# Altium schematic sheet DEMO_mega16_2020_SMT.SchDoc
size A3
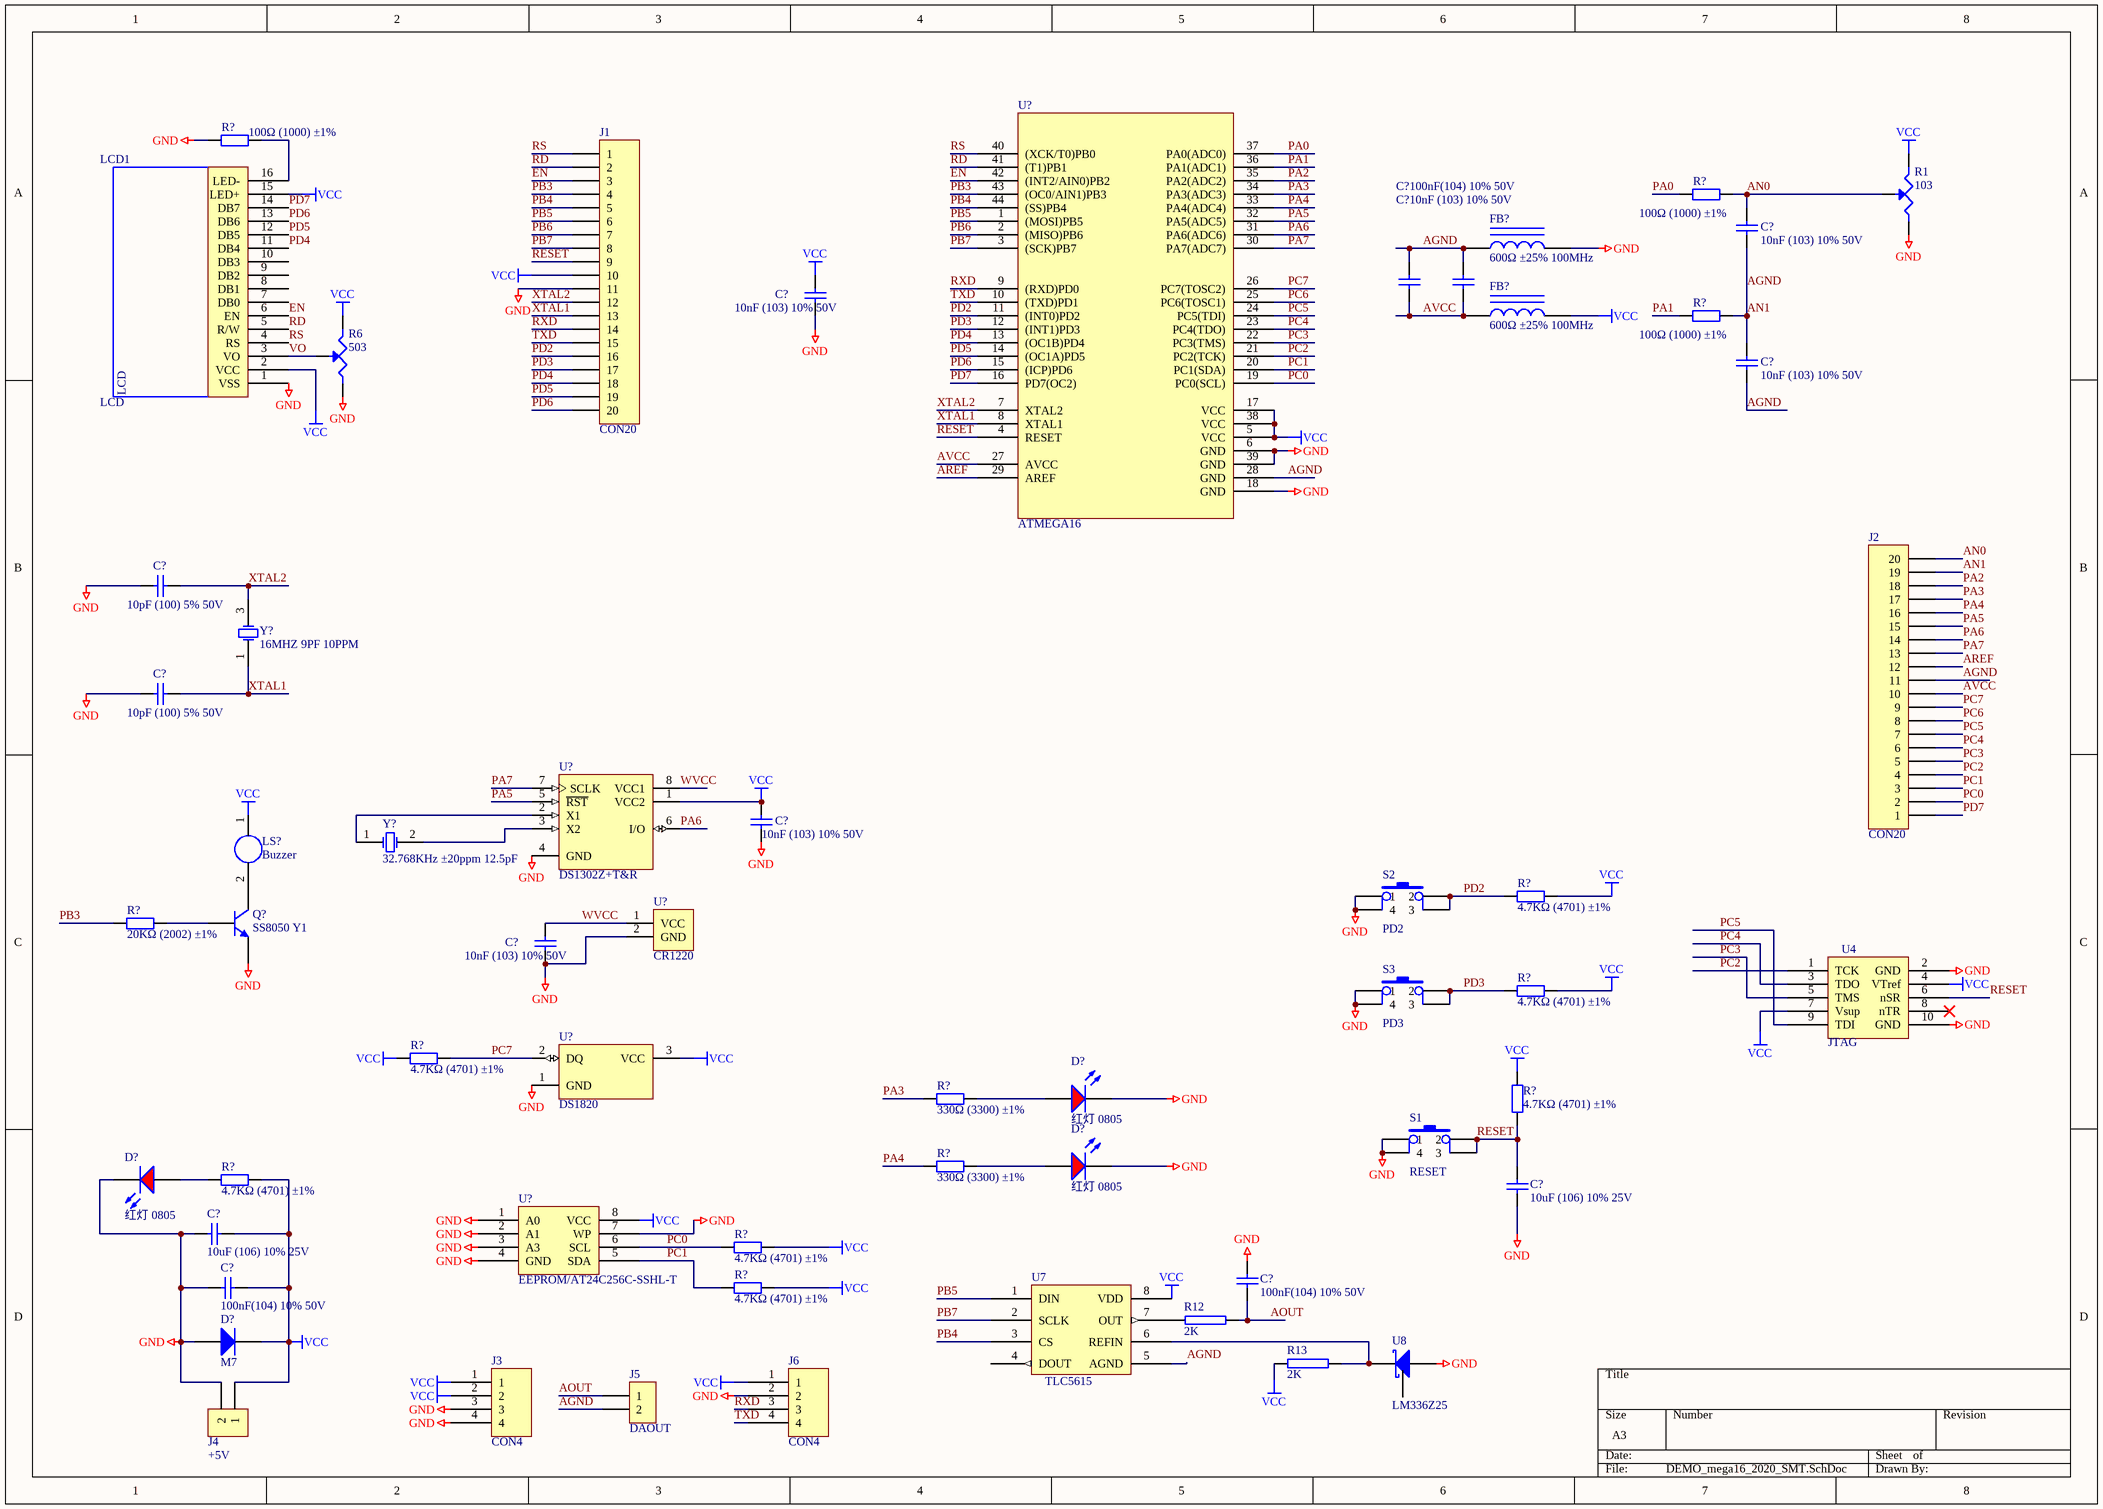
[diagram p0: DEMO_mega16_2020_SMT.SchDoc]

## Parts
(Parts that share a designator on the sheet are numbered #1, #2 ... from top to bottom, then left to right.)
C?#1  10nF (103) 10% 50V  [0805_C]
C?#2  10nF (103) 10% 50V  [0805_C]
C?#3  100nF(104) 10% 50V  [0805_C]
C?#4  10nF (103) 10% 50V  [0805_C]
C?#5  10nF (103) 10% 50V  [0805_C]
C?#6  10pF (100) 5% 50V  [0805_C]
C?#7  10pF (100) 5% 50V  [0805_C]
C?#8  10nF (103) 10% 50V  [0805_C]
C?#9  10nF (103) 10% 50V  [0805_C]
C?#10  10uF (106) 10% 25V  [0805_C]
C?#11  10uF (106) 10% 25V  [0805_C]
C?#12  100nF(104) 10% 50V  [0805_C]
C?#13  100nF(104) 10% 50V  [0805_C]
D?#1  红灯 0805  [0805_LED_S1]
D?#2  红灯 0805  [0805_LED_S1]
D?#3  红灯 0805  [0805_LED_S1]
D?#4  M7  [SMA(DO-214AC)_S1]
FB?#1  600Ω ±25% 100MHz  [0805_L]
FB?#2  600Ω ±25% 100MHz  [0805_L]
J1  CON20  [SIP20]
J2  CON20  [SIP20]
J3  CON4  [SIP4]
J4  +5V  [SIP2]
J5  DAOUT  [SIP2]
J6  CON4  [SIP4]
LCD1  LCD  [SIP16]
LS?  Buzzer  [Buzzer]
Q?  SS8050 Y1  [SOT-23(SOT-23-3)]
R1  103  [VR5]
R6  503  [VR5]
R12  2K  [0805]
R13  2K  [0805]
R?#1  100Ω (1000) ±1%  [0805_R]
R?#2  100Ω (1000) ±1%  [0805_R]
R?#3  100Ω (1000) ±1%  [0805_R]
R?#4  4.7KΩ (4701) ±1%  [0805_R]
R?#5  20KΩ (2002) ±1%  [0805_R]
R?#6  4.7KΩ (4701) ±1%  [0805_R]
R?#7  4.7KΩ (4701) ±1%  [0805_R]
R?#8  330Ω (3300) ±1%  [0805_R]
R?#9  4.7KΩ (4701) ±1%  [0805_R]
R?#10  330Ω (3300) ±1%  [0805_R]
R?#11  4.7KΩ (4701) ±1%  [0805_R]
R?#12  4.7KΩ (4701) ±1%  [0805_R]
R?#13  4.7KΩ (4701) ±1%  [0805_R]
S1  RESET  [SW-PB]
S2  PD2  [SW-PB]
S3  PD3  [SW-PB]
U4  JTAG  [IDC10]
U7  TLC5615  [TLC5615]
U8  LM336Z25  [三极管]
U?#1  ATMEGA16  [TQFP44]
U?#2  DS1302Z+T&R  [SOIC-8_150mil]
U?#3  CR1220  [CR1220]
U?#4  DS1820  [三极管]
U?#5  EEPROM/AT24C256C-SSHL-T  [SOIC-8_150mil]
Y?#1  16MHZ 9PF 10PPM  [SMD-3225_4P]
Y?#2  32.768KHz ±20ppm 12.5pF  [SMD-3215_2P FC - 135]

## Nets
GND: C?#4.1 C?#6.1 C?#7.1 C?#8.1 C?#9.1 C?#10.1 C?#11.1 C?#12.1 C?#13.2 D?#1.K D?#2.K D?#3.K D?#4.1(A) FB?#1.2 J1.11 J3.3 J3.4 J4.2 J6.2 LCD1.1(VSS) Q?.2(E) R1.3 R6.3 R?#1.1 S1.1 S1.4 S2.1 S2.4 S3.1 S3.4 U4.2(GND) U4.10(GND) U8.3(-) U?#1.6(GND) U?#1.18(GND) U?#1.39(GND) U?#2.4(GND) U?#3.2(GND) U?#4.1(GND) U?#5.1(A0) U?#5.2(A1) U?#5.3(A3) U?#5.4(GND) U?#5.7(WP)
VCC: C?#4.2 C?#8.2 C?#10.2 C?#12.2 D?#4.2(K) FB?#2.2 J1.10 J3.1 J3.2 J4.1 J6.1 LCD1.2(VCC) LCD1.15(LED+) LS?.1 R1.1 R6.1 R13.1 R?#4.2 R?#6.2 R?#7.1 R?#9.2 R?#11.2 R?#12.2 R?#13.2 U4.4(VTref) U4.7(Vsup) U7.8(VDD) U?#1.5(VCC) U?#1.17(VCC) U?#1.38(VCC) U?#2.1(VCC2) U?#4.3(VCC) U?#5.8(VCC)
AGND: C?#1.1 C?#2.2 C?#3.2 C?#5.1 C?#5.2 FB?#1.1 J2.11 J2.19 J5.2 R?#3.2 U7.5(AGND) U?#1.28(GND)  [also labelled AN1]
AN0: C?#1.2 J2.20 R1.2 R?#2.2
AOUT: C?#13.1 J5.1 R12.2
AREF: J2.12 U?#1.29(AREF)
AVCC: C?#2.1 C?#3.1 FB?#2.1 J2.10 U?#1.27(AVCC)
EN: J1.3 LCD1.6(EN) U?#1.42((INT2/AIN0)PB2)
PA0: R?#2.1 U?#1.37(PA0(ADC0))
PA1: R?#3.1 U?#1.36(PA1(ADC1))
PA2: J2.18 U?#1.35(PA2(ADC2))
PA3: J2.17 R?#8.1 U?#1.34(PA3(ADC3))
PA4: J2.16 R?#10.1 U?#1.33(PA4(ADC4))
PA5: J2.15 U?#1.32(PA5(ADC5)) U?#2.5(~{RST})
PA6: J2.14 U?#1.31(PA6(ADC6)) U?#2.6(I/O)
PA7: J2.13 U?#1.30(PA7(ADC7)) U?#2.7(SCLK)
PB3: J1.4 R?#5.1 U?#1.43((OC0/AIN1)PB3)
PB4: J1.5 U7.3(CS) U?#1.44((SS)PB4)
PB5: J1.6 U7.1(DIN) U?#1.1((MOSI)PB5)
PB6: J1.7 U?#1.2((MISO)PB6)
PB7: J1.8 U7.2(SCLK) U?#1.3((SCK)PB7)
PC0: J2.2 R?#12.1 U?#1.19(PC0(SCL)) U?#5.6(SCL)
PC1: J2.3 R?#13.1 U?#1.20(PC1(SDA)) U?#5.5(SDA)
PC2: J2.4 U4.1(TCK) U?#1.21(PC2(TCK))
PC3: J2.5 U4.5(TMS) U?#1.22(PC3(TMS))
PC4: J2.6 U4.3(TDO) U?#1.23(PC4(TDO))
PC5: J2.7 U4.9(TDI) U?#1.24(PC5(TDI))
PC6: J2.8 U?#1.25(PC6(TOSC1))
PC7: J2.9 R?#7.2 U?#1.26(PC7(TOSC2)) U?#4.2(DQ)
PD2: J1.16 R?#4.1 S2.2 S2.3 U?#1.11((INT0)PD2)
PD3: J1.17 R?#6.1 S3.2 S3.3 U?#1.12((INT1)PD3)
PD4: J1.18 LCD1.11(DB4) U?#1.13((OC1B)PD4)
PD5: J1.19 LCD1.12(DB5) U?#1.14((OC1A)PD5)
PD6: J1.20 LCD1.13(DB6) U?#1.15((ICP)PD6)
PD7: J2.1 LCD1.14(DB7) U?#1.16(PD7(OC2))
RD: J1.2 LCD1.5(R/W) U?#1.41((T1)PB1)
RESET: C?#11.2 J1.9 R?#9.1 S1.2 S1.3 U4.6(nSR) U?#1.4(RESET)
RS: J1.1 LCD1.4(RS) U?#1.40((XCK/T0)PB0)
RXD: J1.14 J6.3 U?#1.9((RXD)PD0)
TXD: J1.15 J6.4 U?#1.10((TXD)PD1)
VO: LCD1.3(VO) R6.2
WVCC: C?#9.2 U?#2.8(VCC1) U?#3.1(VCC)
XTAL1: C?#7.2 J1.13 U?#1.8(XTAL1) Y?#1.1(OSC1)
XTAL2: C?#6.2 J1.12 U?#1.7(XTAL2) Y?#1.3(OSC2)
NetD?#1_A: D?#1.A R?#8.2
NetD?#2_A: D?#2.A R?#10.2
NetD?#3_A: D?#3.A R?#11.1
NetLCD1_16: LCD1.16(LED-) R?#1.2
NetLS?_2: LS?.2 Q?.3(C)
NetQ?_1: Q?.1(B) R?#5.2
NetR12_1: R12.1 U7.7(OUT)
NetR13_2: R13.2 U7.6(REFIN) U8.2(+)
NetU?#2_2: U?#2.2(X1) Y?#2.1(OSC1)
NetU?#2_3: U?#2.3(X2) Y?#2.2(OSC2)

Not connected (* = marked no-connect by the designer): LCD1 7(DB0) 8(DB1) 9(DB2) 10(DB3); U4 8(nTR)*; U7 4(DOUT); U8 1(ADJ)

## Library data of the parts
C?#1 C?#2 C?#4 C?#5 C?#8 C?#9 = 0805 10nF (103) 10% 50V: 贴片电容; ComponentLink1Description: 供应商链接; ComponentLink1URL: http://www.szlcsc.com/product/details_2062.html; Package: 0805; Supplier: LC; SuppliersPartNumber: C1710
C?#3 C?#12 C?#13 = 0805 100nF(104) 10% 50V: 贴片电容; ComponentLink1Description: 供应商链接; ComponentLink1URL: http://www.szlcsc.com/product/details_50686.html; Package: 0805; Supplier: LC; SuppliersPartNumber: C49678
C?#6 C?#7 = 0805 10pF (100) 5% 50V: 贴片电容; ComponentLink1Description: 供应商链接; ComponentLink1URL: http://www.szlcsc.com/product/details_2137.html; Package: 0805; Supplier: LC; SuppliersPartNumber: C1785
C?#10 C?#11 = 0805 10uF (106) 10% 25V: 贴片电容; ComponentLink1Description: 供应商链接; ComponentLink1URL: http://www.szlcsc.com/product/details_16532.html; Package: 0805; Supplier: LC; SuppliersPartNumber: C15850
D?#1-D?#3 = 0805 红灯: 发光二极管; ComponentLink1Description: 供应商链接; ComponentLink1URL: http://www.szlcsc.com/product/details_2668.html; Package: 0805; Supplier: LC; SuppliersPartNumber: C2295
D?#4 = SMA(DO-214AC) M7: 二极管; Notepad: 1N4007 4007 编号C2464 已经停售, 使用新物料编号C95872; ComponentLink1Description: 供应商链接; ComponentLink1URL: http://www.szlcsc.com/product/details_2841.html; Package: SMA(DO-214AC); Supplier: LC; SuppliersPartNumber: C95872
FB?#1 FB?#2 = 0805 600Ω 25% 100MHz: 贴片磁珠; ComponentLink1Description: 供应商链接; ComponentLink1URL: http://www.szlcsc.com/product/details_1369.html; Package: 0805; Supplier: LC; SuppliersPartNumber: C1017
J1 J2 = CON20: Connector
J4 J5 = CON2: Connector
LS? = Buzzer: Buzzer Made in China
Q? = SOT-23 SS8050 Y1: 三极管; ComponentLink1Description: 供应商链接; ComponentLink1URL: http://www.szlcsc.com/product/details_2507.html; Package: SOT-23; Supplier: LC; SuppliersPartNumber: C2150
R1 R6 = POT: Potentiometer; Setting: *
R12 R13 = RES2
R?#1-R?#3 = 0805 100Ω (1000) 1%: 贴片电阻; ComponentLink1Description: 供应商链接; ComponentLink1URL: http://www.szlcsc.com/product/details_18096.html; Package: 0805; Supplier: LC; SuppliersPartNumber: C17408
R?#4 R?#6 R?#7 R?#9 R?#11-R?#13 = 0805 4.7KΩ (4701) 1%: 贴片电阻; ComponentLink1Description: 供应商链接; ComponentLink1URL: http://www.szlcsc.com/product/details_18361.html; Package: 0805; Supplier: LC; SuppliersPartNumber: C17673
R?#5 = 0805 20KΩ (2002) 1%: 贴片电阻; ComponentLink1Description: 供应商链接; ComponentLink1URL: http://www.szlcsc.com/product/details_4735.html; Package: 0805; Supplier: LC; SuppliersPartNumber: C4328
R?#8 R?#10 = 0805 330Ω (3300) 1%: 贴片电阻; ComponentLink1Description: 供应商链接; ComponentLink1URL: http://www.szlcsc.com/product/details_18318.html; Package: 0805; Supplier: LC; SuppliersPartNumber: C17630
S1-S3 = SW-PB4
U?#1 = MEGA16PQFP: MEGA16; Text Field1: MEGA16; MEGA16: *
U?#2 = DS1302Z+T&R_[C8959]: 实时时钟; ComponentLink1Description: 供应商链接; ComponentLink1URL: http://www.szlcsc.com/product/details_9478.html; Package: SOIC-8_150mil; Supplier: LC; SuppliersPartNumber: C8959
U?#4 = DS1820: 1-Wire Digital Thermometer; ComponentAvailability: Obsolete; Published: 13-Oct-2000; LatestRevisionDate: 17-Jul-2002; LatestRevisionNote: Re-released for DXP Platform.; DatasheetVersion: 5-Mar-1998; PackageVersion: 1999; PackageReference: PR35; Publisher: Altium Limited; PackageDescription: TO, Flat Index; 3 In-Line, Axial Leads; Body Dia. 4.6mm; Leads 0.56 x 0.51 mm (max); ComponentLink1Description: Manufacturer Link; ComponentLink1URL: http://www.maxim-ic.com/; ComponentLink2Description: Datasheet; ComponentLink2URL: http://pdfserv.maxim-ic.com/en/ds/DS1820-DS1820S.pdf; ComponentLink3Description: Discontinuation Notice; ComponentLink3URL: http://www.maxim-ic.com/qa/pdfs/non-obsolescence-letter.pdf
U?#5 = EEPROM/AT24C256C-SSHL-T_[C6482]: EEPROM; ComponentLink1Description: 供应商链接; ComponentLink1URL: http://www.szlcsc.com/product/details_6947.html; Package: SOIC-8_150mil; Supplier: LC; SuppliersPartNumber: C6482
Y?#1 = SMD-3225_4P  16MHZ 9PF 10PPM: 贴片晶振; ComponentLink1Description: 供应商链接; ComponentLink1URL: http://www.szlcsc.com/product/details_14393.html; Package: SMD-3225_4P; Supplier: LC; SuppliersPartNumber: C13738
Y?#2 = SMD-3215_2P 32.768KHz 20ppm 12.5pF: 贴片晶振; ComponentLink1Description: 供应商链接; ComponentLink1URL: http://www.szlcsc.com/product/details_33310.html; Package: SMD-3215_2P; Supplier: LC; SuppliersPartNumber: C32346
U4 = JTAG: Text Field1: JTAG; JTAG: *